# EAGLE design lightctrl (EAGLE 7.7.0)
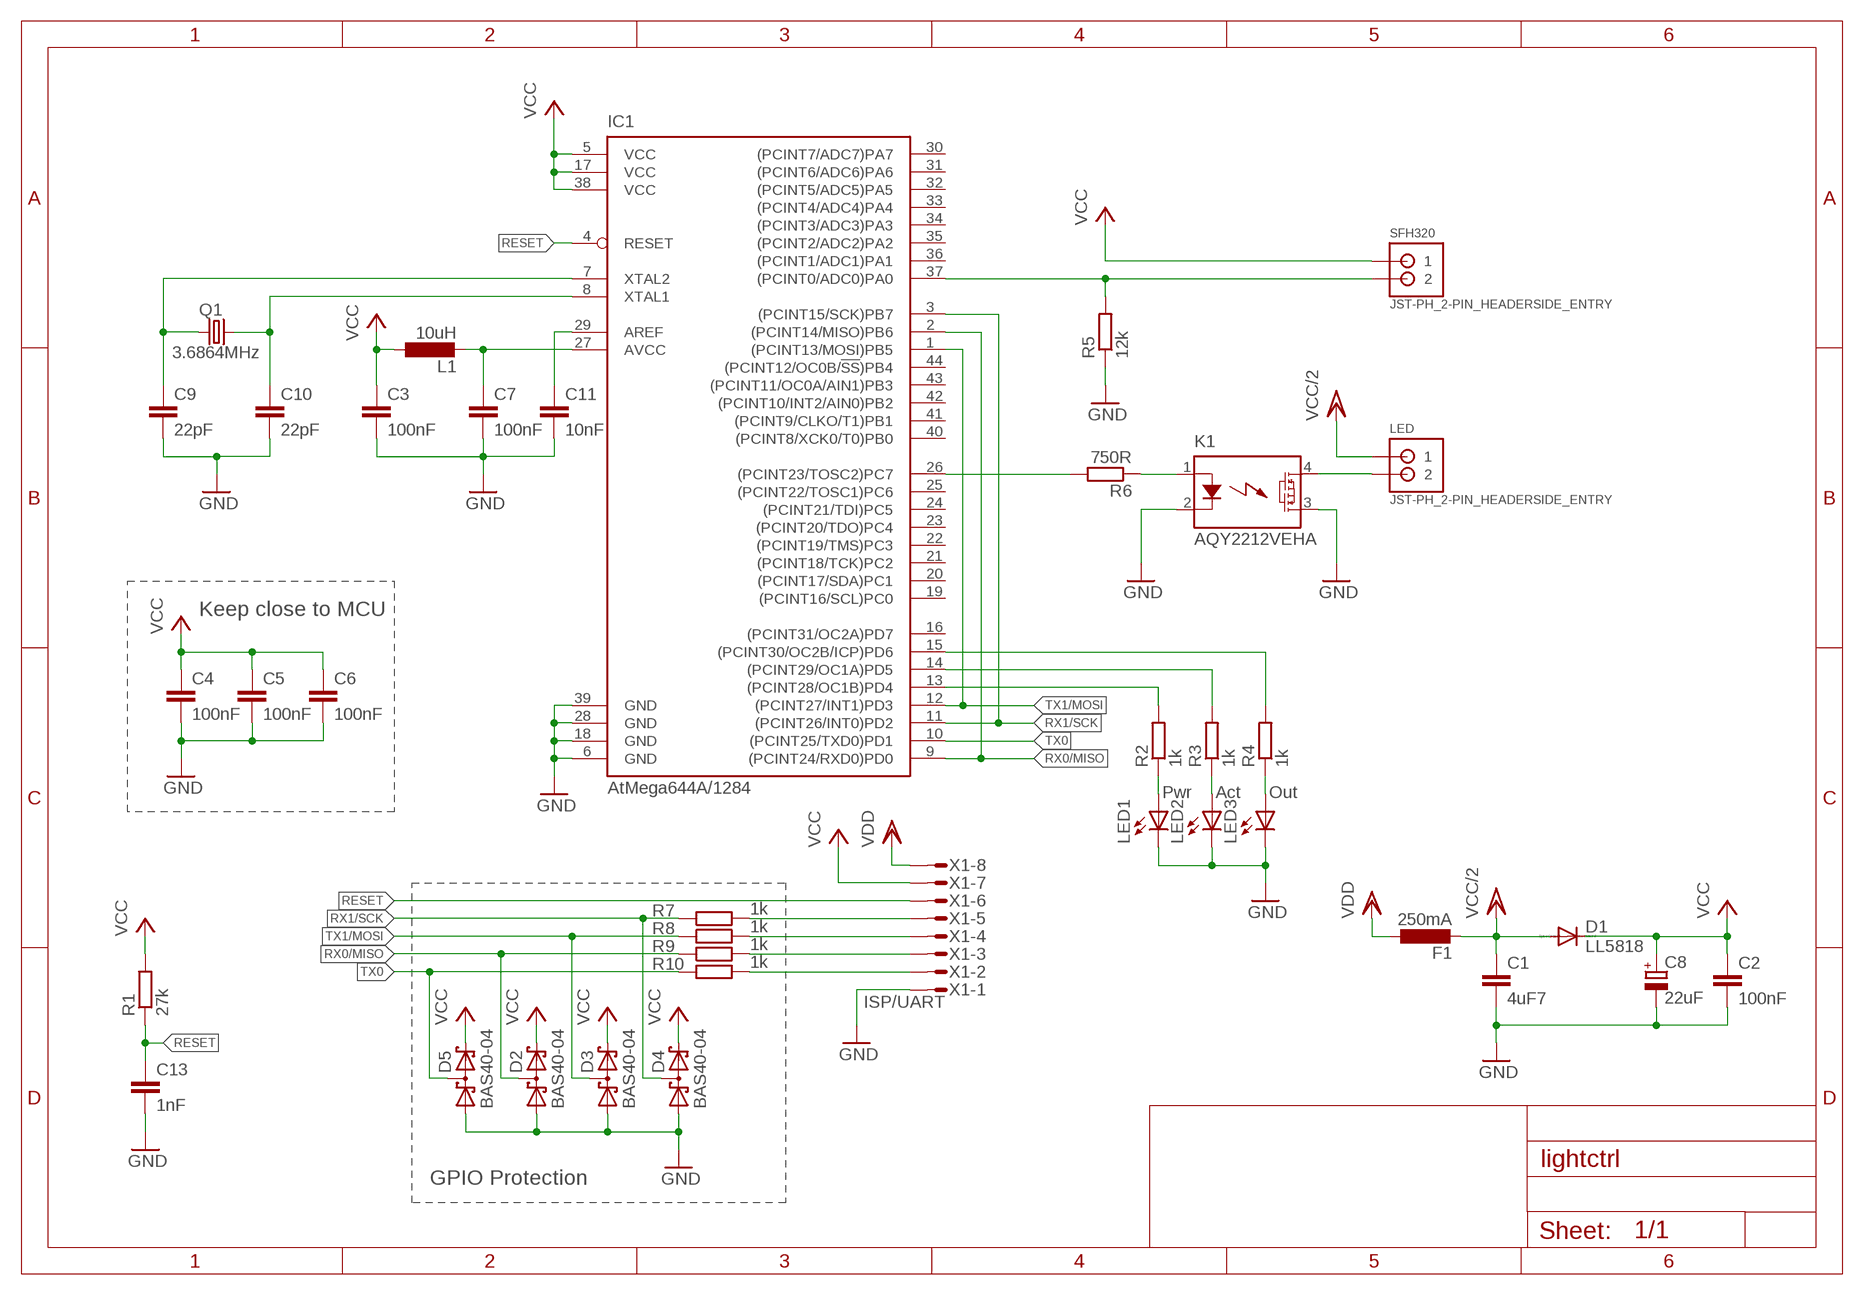
[diagram p0: schematic, sheet 1]

## Parts
C1  4uF7  C-EUC1206  [C1206]
C2  100nF  C-EUC1206  [C1206]
C3  100nF  C-EUC1206  [C1206]
C4  100nF  C-EUC1206  [C1206]
C5  100nF  C-EUC1206  [C1206]
C6  100nF  C-EUC1206  [C1206]
C7  100nF  C-EUC1206  [C1206]
C8  22uF  CPOL-EUSMCD  [SMC_D]
C9  22pF  C-EUC1206  [C1206]
C10  22pF  C-EUC1206  [C1206]
C11  10nF  C-EUC1206  [C1206]
C13  1nF  C-EUC1206  [C1206]
D1  LL5818  DIODE-MELF-MLL41  [MELF-MLL41]
D2  BAS40-04  [SOT23]
D3  BAS40-04  [SOT23]
D4  BAS40-04  [SOT23]
D5  BAS40-04  [SOT23]
F1  250mA  L-EUL1812  [L1812]
IC1  AtMega644A/1284  ATMEGA644A  [TQFP44]
K1  AQY2212VEHA  [SMD-DIP04]
L1  10uH  L-EUL3230M  [L3230M]
LED  JST-PH_2-PIN_HEADERSIDE_ENTRY  [S2B-PH_HEADER]
LED1  Pwr  LEDCHIPLED_1206  [CHIPLED_1206]
LED2  Act  LEDCHIPLED_1206  [CHIPLED_1206]
LED3  Out  LEDCHIPLED_1206  [CHIPLED_1206]
Q1  3.6864MHz  CRYSTALHC49UP  [HC49UP]
R1  27k  R-EU_R1206  [R1206]
R2  1k  R-EU_R1206  [R1206]
R3  1k  R-EU_R1206  [R1206]
R4  1k  R-EU_R1206  [R1206]
R5  12k  R-EU_R1206  [R1206]
R6  750R  R-EU_R1206  [R1206]
R7  1k  R-EU_R1206  [R1206]
R8  1k  R-EU_R1206  [R1206]
R9  1k  R-EU_R1206  [R1206]
R10  1k  R-EU_R1206  [R1206]
SFH320  JST-PH_2-PIN_HEADERSIDE_ENTRY  [S2B-PH_HEADER]
X1  ISP/UART  MICROMATCH-8  [MICROMATCH-8]

## Nets
GND: C1.2 C2.2 C3.2 C4.2 C5.2 C6.2 C7.2 C8.- C9.2 C10.2 C11.2 C13.2 D2.1(A1) D3.1(A1) D4.1(A1) D5.1(A1) IC1.6(GND) IC1.18(GND) IC1.28(GND) IC1.39(GND) K1.2(K) K1.3(DS2) LED1.C LED2.C LED3.C R5.1 X1.1
N$1: C7.1 IC1.27(AVCC) L1.2
N$2: IC1.37((PCINT0/ADC0)PA0) R5.2 SFH320.P2
N$3: C11.1 IC1.29(AREF)
N$4: C10.1 IC1.8(XTAL1) Q1.2
N$5: C9.1 IC1.7(XTAL2) Q1.1
N$6: K1.4(DS1) LED.P2
N$7: LED1.A R2.1
N$8: LED2.A R3.1
N$9: LED3.A R4.1
N$10: IC1.13((PCINT28/OC1B)PD4) R2.2
N$11: IC1.14((PCINT29/OC1A)PD5) R3.2
N$12: IC1.15((PCINT30/OC2B/ICP)PD6) R4.2
N$13: R7.2 X1.5
N$14: K1.1(A) R6.1
N$15: R8.2 X1.4
N$16: R9.2 X1.3
N$17: IC1.26((PCINT23/TOSC2)PC7) R6.2
N$18: R10.2 X1.2
RESET: C13.1 IC1.4(RESET) R1.1 X1.6
RX0/MISO: D2.3(C1A2) IC1.2((PCINT14/MISO)PB6) IC1.9((PCINT24/RXD0)PD0) R9.1
RX1/SCK: D4.3(C1A2) IC1.3((PCINT15/SCK)PB7) IC1.11((PCINT26/INT0)PD2) R7.1
TX0: D5.3(C1A2) IC1.10((PCINT25/TXD0)PD1) R10.1
TX1/MOSI: D3.3(C1A2) IC1.1((PCINT13/MOSI)PB5) IC1.12((PCINT27/INT1)PD3) R8.1
VCC: C2.1 C3.1 C4.1 C5.1 C6.1 C8.+ D1.C D2.2(C2) D3.2(C2) D4.2(C2) D5.2(C2) IC1.5(VCC) IC1.17(VCC) IC1.38(VCC) L1.1 R1.2 SFH320.P1 X1.7
VCC/2: C1.1 D1.A F1.2 LED.P1
VDD: F1.1 X1.8
Unconnected: IC1.16((PCINT31/OC2A)PD7) IC1.19((PCINT16/SCL)PC0) IC1.20((PCINT17/SDA)PC1) IC1.21((PCINT18/TCK)PC2) IC1.22((PCINT19/TMS)PC3) IC1.23((PCINT20/TDO)PC4) IC1.24((PCINT21/TDI)PC5) IC1.25((PCINT22/TOSC1)PC6) IC1.30((PCINT7/ADC7)PA7) IC1.31((PCINT6/ADC6)PA6) IC1.32((PCINT5/ADC5)PA5) IC1.33((PCINT4/ADC4)PA4) IC1.34((PCINT3/ADC3)PA3) IC1.35((PCINT2/ADC2)PA2) IC1.36((PCINT1/ADC1)PA1) IC1.40((PCINT8/XCK0/T0)PB0) IC1.41((PCINT9/CLKO/T1)PB1) IC1.42((PCINT10/INT2/AIN0)PB2) IC1.43((PCINT11/OC0A/AIN1)PB3) IC1.44((PCINT12/OC0B/!SS!)PB4)

## Notes on the sheet
- Keep close to MCU
- GPIO Protection

## Library data of the parts
C1-C7 C9-C11 C13 = rcl:C-EU: CAPACITOR, European symbol
C8 = rcl:CPOL-EU: POLARIZED CAPACITOR, European symbol
D1 = diode:DIODE-: DIODE
D2-D5 = diode:BAS40-04: Silicon Schottky Diodes General-purpose diode for high-speed switching
F1 L1 = rcl:L-EU: INDUCTOR, European symbol
IC1 = atmel:ATMEGA644: 8-bit Microcontroller with 64K Bytes In-System Programmable Flash Source: http://www.atmel.com/dyn/resources/prod_documents/doc2593.pdf; MPN: ATMEGA644PV-10AU; OC_FARNELL: 1455123; OC_NEWARK: 58M3748
K1 = tpv:AQY221*2V: PHOTOMOS Relay RF (Radio Frequency) NAiS C . R 10 SSOP Type; Source: http://www.mew-europe.com/.. aqy221_2v.pdf
LED SFH320 = con-jst-ph:JST-PH_2-PIN_HEADER: 2-pin JST PH Shrouded Header P/N B2B-PH-K-S Mating connector PHR-2 Mating cable assembly: Sparkfun PRT-09914 <http://www.sparkfun.com/products/9914>
LED1-LED3 = led:LED: LED OSRAM: - CHIPLED LG R971, LG N971, LY N971, LG Q971, LY Q971, LO R971, LY R971 LH N974, LH R974 LS Q976, LO Q976, LY Q976 LO Q996 - Hyper CHIPLED LW Q18S LB Q993, LB Q99A, LB R99A - SideLED LS A670, LO A670, LY A670, LG A670, LP A670 LB A673, LV A673, LT A673, LW A673 LH A674 LY A675 LS A676, LA A676, LO A676, LY A676, LW A676 LS A679, LY A679, LG A679 - Hyper Micro SIDELED® LS Y876, LA Y876, LO Y876, LY Y876 LT Y87S - SmartLED LW L88C, LW L88S LB L89C, LB L89S, LG L890 LS L89K, LO L89K, LY L89K LS L896, LA L896, LO L896, LY L896 - TOPLED LS T670, LO T670, LY T670, LG T670, LP T670 LSG T670, LSP T670, LSY T670, LOP T670, LYG T670 LG T671, LOG T671, LSG T671 LB T673, LV T673, LT T673, LW T673 LH T674 LS T676, LA T676, LO T676, LY T676, LB T676, LH T676, LSB T676, LW T676 LB T67C, LV T67C, LT T67C, LS T67K, LO T67K, LY T67K, LW E67C LS E67B, LA E67B, LO E67B, LY E67B, LB E67C, LV E67C, LT E67C LW T67C LS T679, LY T679, LG T679 LS T770, LO T770, LY T770, LG T770, LP T770 LB T773, LV T773, LT T773, LW T773 LH T774 LS E675, LA E675, LY E675, LS T675 LS T776, LA T776, LO T776, LY T776, LB T776 LHGB T686 LT T68C, LB T68C - Hyper Mini TOPLED® LB M676 - Mini TOPLED Santana® LG M470 LS M47K, LO M47K, LY M47K Source: http://www.osram.convergy.de LUXEON: - LUMILED® LXK2-PW12-R00, LXK2-PW12-S00, LXK2-PW14-U00, LXK2-PW14-V00 LXK2-PM12-R00, LXK2-PM12-S00, LXK2-PM14-U00 LXK2-PE12-Q00, LXK2-PE12-R00, LXK2-PE12-S00, LXK2-PE14-T00, LXK2-PE14-U00 LXK2-PB12-K00, LXK2-PB12-L00, LXK2-PB12-M00, LXK2-PB14-N00, LXK2-PB14-P00, LXK2-PB14-Q00 LXK2-PR12-L00, LXK2-PR12-M00, LXK2-PR14-Q00, LXK2-PR14-R00 LXK2-PD12-Q00, LXK2-PD12-R00, LXK2-PD12-S00 LXK2-PH12-R00, LXK2-PH12-S00 LXK2-PL12-P00, LXK2-PL12-Q00, LXK2-PL12-R00 Source: www.luxeon.com KINGBRIGHT: KA-3528ASYC Source: www.kingbright.com
Q1 = crystal:CRYSTAL: CRYSTAL; OC_FARNELL: unknown; OC_NEWARK: unknown
R1-R10 = rcl:R-EU_: RESISTOR, European symbol
X1 = con-amp-micromatch:MICROMATCH-8: MicroMaTch 8 7-215464-8 / 0-215464-8 Drawing Number C-215464 DDEController.pdf; MF: FARNELL; MPN: 7-215464-8; OC_FARNELL: 3784642; OC_NEWARK: 26H0301

## Board
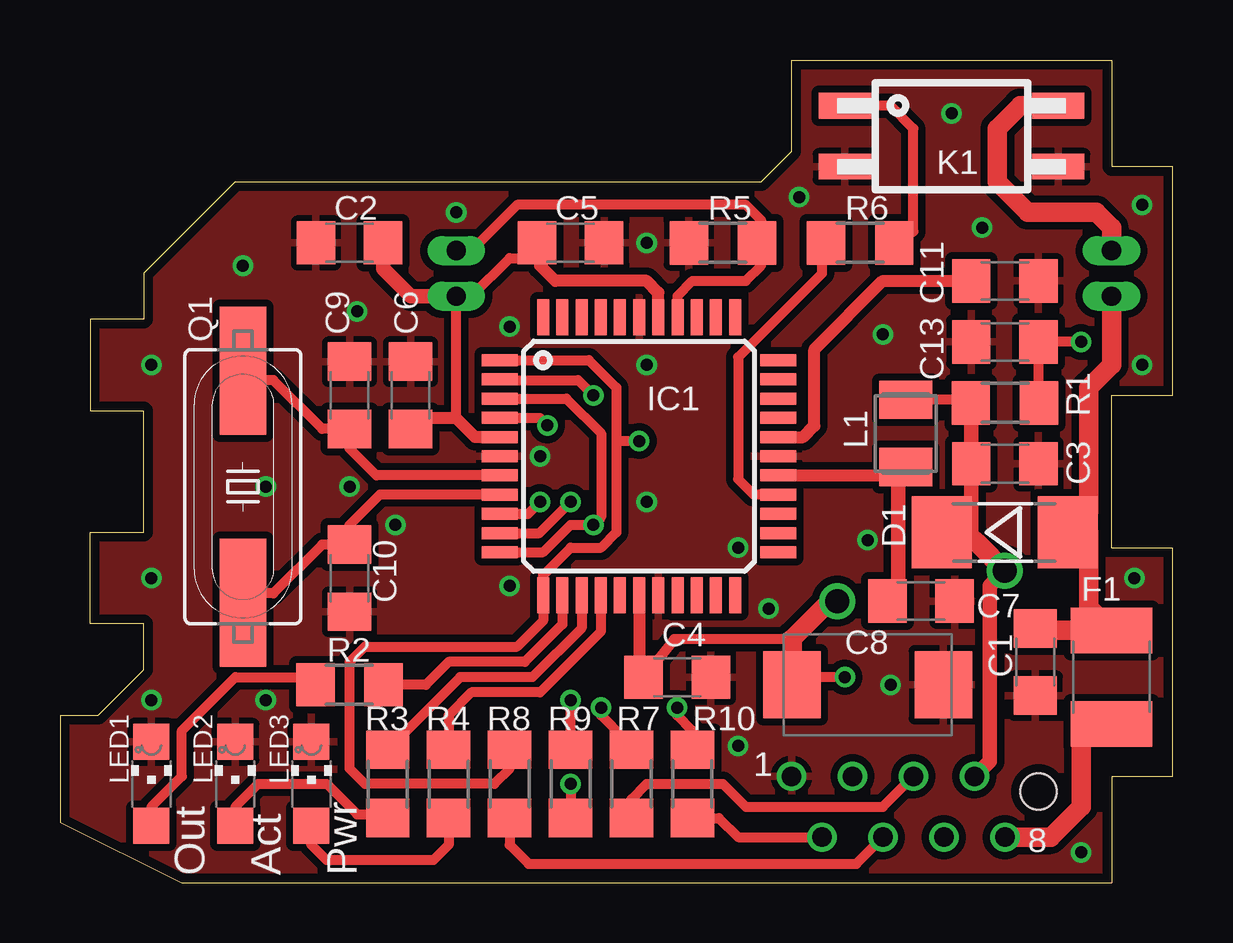
[diagram p1: board, top side]
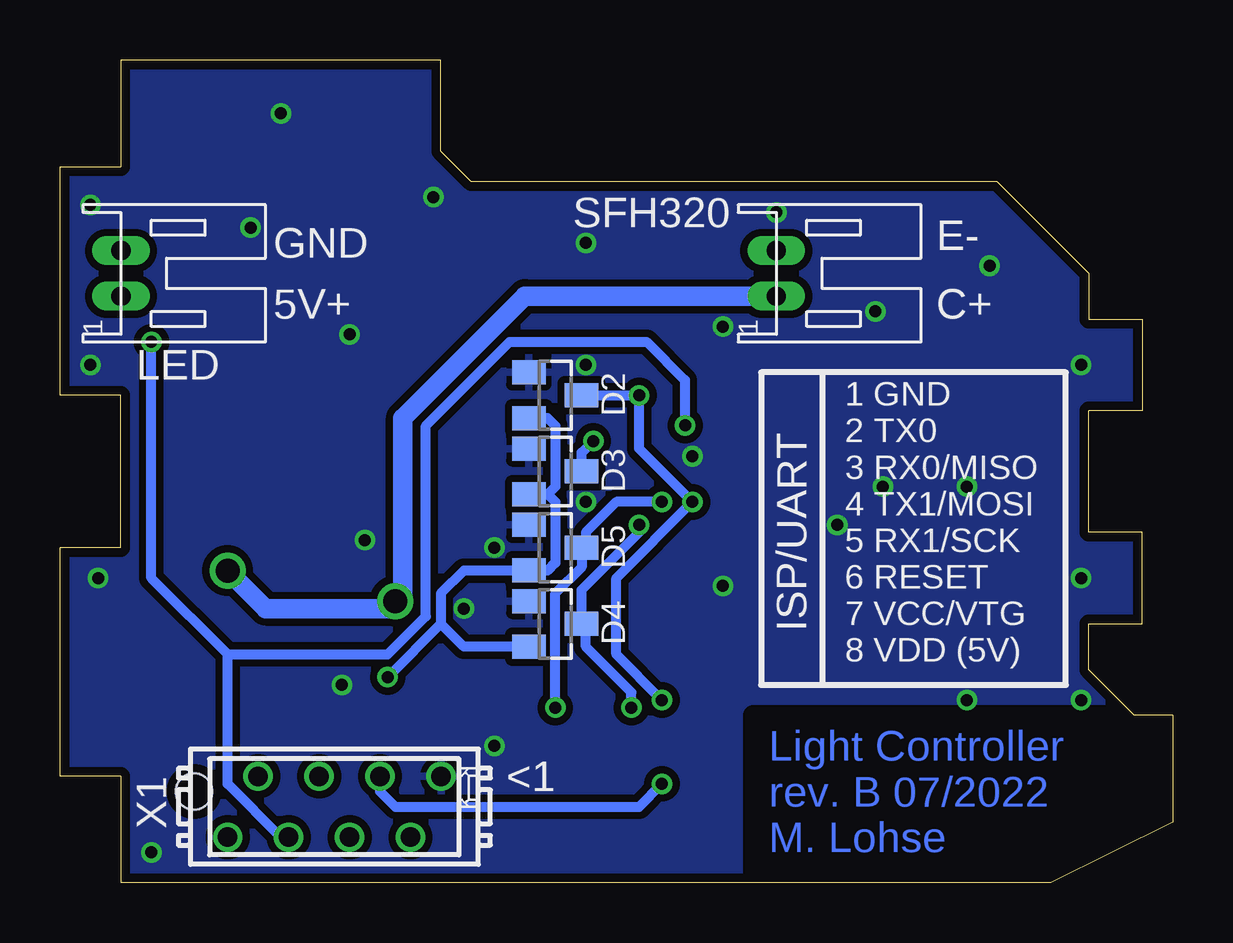
[diagram p2: board, bottom side, seen from below]

Size 46.35 x 34.29 mm. Coordinates in mm from the lower left corner, seen from the top.
Outline: 5.08,0 43.81,0 43.81,4.45 46.35,4.45 46.35,13.97 43.81,13.97 43.81,20.32 46.35,20.32 46.35,29.84 43.81,29.84 43.81,34.29 30.48,34.29 30.48,30.48 29.21,29.21 7.3,29.21 3.49,25.4 3.49,23.5 1.27,23.5 1.27,19.68 3.49,19.68 3.49,14.61 1.27,14.61 1.27,10.79 3.49,10.79 3.49,8.89 1.59,6.99 0,6.99 0,2.54 5.08,0
Copper layers (1*16): Top 0.0356mm / dielectric 1.5011mm / Bottom 0.0356mm
Design rules "LaenPCBOrder": minimum track width 6mil, minimum drill 13mil, track to track 6mil, track to pad 6mil, pad to pad 6mil, via to via 6mil, smd to smd 6mil, copper to edge 15mil, drill to drill 6mil, minimum pad ring 7mil, minimum via ring 7mil, stop-mask expansion 3mil, vias tented up to drill 0mil, thermal gap 10mil
bRestrict: 5 lines

### Footprints (pad centres in the part's own frame; a part is rotated, then mirrored left to right if it is on the bottom)
C1206 = smd 1.6 x 1.8: 1 -1.4,0; 2 1.4,0
SMC_D = smd 2.4 x 2.8: + -3.15,0; - 3.15,0
MELF-MLL41 = smd 2.5 x 3: A 2.625,0; C -2.625,0
SOT23 = smd 1 x 1.4: 1 -0.95,-1.1; 2 0.95,-1.1; 3 0,1.1
L1812 = smd 1.9 x 3.4: 1 -1.95,0; 2 1.95,0
TQFP44 = smd 1.5 x 0.5: 1 -5.8,4; 2 -5.8,3.2; 3 -5.8,2.4; 4 -5.8,1.6; 5 -5.8,0.8; 6 -5.8,0; 7 -5.8,-0.8; 8 -5.8,-1.6; 9 -5.8,-2.4; 10 -5.8,-3.2; 11 -5.8,-4; 23 5.8,-4; 24 5.8,-3.2; 25 5.8,-2.4; 26 5.8,-1.6; 27 5.8,-0.8; 28 5.8,0; 29 5.8,0.8; 30 5.8,1.6; 31 5.8,2.4; 32 5.8,3.2; 33 5.8,4 | smd 0.5 x 1.5: 12 -4,-5.8; 13 -3.2,-5.8; 14 -2.4,-5.8; 15 -1.6,-5.8; 16 -0.8,-5.8; 17 0,-5.8; 18 0.8,-5.8; 19 1.6,-5.8; 20 2.4,-5.8; 21 3.2,-5.8; 22 4,-5.8; 34 4,5.8; 35 3.2,5.8; 36 2.4,5.8; 37 1.6,5.8; 38 0.8,5.8; 39 0,5.8; 40 -0.8,5.8; 41 -1.6,5.8; 42 -2.4,5.8; 43 -3.2,5.8; 44 -4,5.8
SMD-DIP04 = smd 2.184 x 1.067: 1 -4.445,1.27; 2 -4.445,-1.27; 3 4.445,-1.27; 4 4.445,1.27
L3230M = smd 1.6 x 2.2: 1 -1.4,0; 2 1.4,0
S2B-PH_HEADER = drill 0.8 long: P1 0.953,-1.905; P2 -0.953,-1.905
CHIPLED_1206 = smd 1.5 x 1.5: A 0,-1.75; C 0,1.75
HC49UP = smd 5.334 x 1.93: 1 -4.826,0; 2 4.826,0
R1206 = smd 1.6 x 1.803: 1 -1.422,0; 2 1.422,0
MICROMATCH-8 = drill 0.813: 1 4.445,1.27; 2 3.175,-1.27; 3 1.905,1.27; 4 0.635,-1.27; 5 -0.635,1.27; 6 -1.905,-1.27; 7 -3.175,1.27; 8 -4.445,-1.27 | hole 1.5: -5.85,0.635

### Placement (x,y rotation side)
C1  40.64,9.21 270 top
C2  12.06,26.67 180 top
C3  39.37,17.46 0 top
C4  25.72,8.57 0 top
C5  21.27,26.67 0 top
C6  14.61,20.32 90 top
C7  35.88,11.75 0 top
C8  33.66,8.26 0 top
C9  12.06,20.32 90 top
C10  12.06,12.7 270 top
C11  39.37,25.08 0 top
C13  39.37,22.54 180 top
D1  39.37,14.61 0 top
D2  25.72,20.32 270 bottom
D3  25.72,17.14 270 bottom
D4  25.72,10.79 270 bottom
D5  25.72,13.97 270 bottom
F1  43.81,8.57 90 top
IC1  24.13,17.78 0 top
K1  37.15,31.11 0 top
L1  35.24,18.73 270 top
LED  41.91,25.4 270 bottom
LED1  3.81,4.13 0 top
LED2  7.3,4.13 0 top
LED3  10.48,4.13 0 top
Q1  7.62,16.51 270 top
R1  39.37,20 180 top
R2  12.06,8.26 0 top
R3  13.65,4.13 90 top
R4  16.19,4.13 90 top
R5  27.62,26.67 0 top
R6  33.34,26.67 180 top
R7  23.81,4.13 270 top
R8  18.73,4.13 270 top
R9  21.27,4.13 270 top
R10  26.35,4.13 270 top
SFH320  14.61,25.4 270 bottom
X1  34.92,3.17 0 bottom

### Tracks (layer width: path | path; a pad name or v marks a point on that pad's centre or on a via)
GND  (via drill 0.5)
  other vias: 44.77,12.7 24.45,21.59 29.53,11.43 3.81,7.62 7.62,25.72 30.8,28.57 24.45,15.88 8.57,16.51 34.61,8.26 38.42,27.3 37.15,32.07 12.38,23.81 20,17.78 12.06,16.51 42.55,1.27 34.29,22.86 45.09,28.26 8.57,7.62 13.97,14.92 28.26,13.97 33.66,14.29 24.45,26.67 18.73,12.38 45.09,21.59 18.73,23.18 16.51,27.94 3.81,21.59 3.81,12.7 28.26,5.71
  pour Bottom (isolate 0.305): 0,0 46.04,0 46.35,34.29 0,34.29
  pour Top (isolate 0.305): 0,0 46.04,0 46.35,34.29 0,34.29
N$1
  Top 0.305: 34.89,16.98 L1.2
  Top 0.5: IC1.27 34.89,16.98
  Top 0.61: L1.2 34.92,17.02 34.92,12.38 34.48,11.94 C7.1
N$2
  Top 0.406: IC1.37 25.73,24.46 26.35,25.08 28.57,25.08 29.21,25.72 29.21,26.5 R5.2 29.21,26.84 29.21,27.62 28.57,28.26 19.05,28.26 17.14,26.35 SFH320.P2
N$3
  Top 0.5: IC1.29 30.96,18.58 31.43,19.05 31.43,22.23 34.29,25.08 C11.1
N$4
  Top 0.406: Q1.2 8,12.06 8.89,12.06 10.93,14.1 C10.1 12.06,14.92 13.34,16.19 18.32,16.19 IC1.8
N$5
  Top 0.406: Q1.1 8,20.95 8.89,20.95 10.93,18.92 C9.1 12.06,18.1 13.18,16.98 IC1.7
N$6
  Top 0.813: K1.4 40.01,32.38 39.05,31.43 39.05,29.21 40.32,27.94 43.18,27.94 43.81,27.3 LED.P2
N$7
  Top 0.406: LED1.A 3.81,3.17 5.08,4.45 5.08,6.35 7.3,8.57 10.32,8.57 R2.1
N$8
  Top 0.406: LED2.A 7.3,3.17 8.26,4.13 11.11,4.13 12.38,2.86 13.5,2.86 R3.1
N$9
  Top 0.406: R4.1 16.19,1.59 15.56,0.95 11.11,0.95 10.48,1.59 LED3.A
N$10
  Top 0.406: IC1.13 20.93,10.77 19.37,9.21 16.19,9.21 15.24,8.26 R2.2
N$11
  Top 0.406: IC1.14 21.73,10.62 19.68,8.57 16.68,8.57 R3.2
N$12
  Top 0.406: IC1.15 22.53,10.46 20,7.94 17.14,7.94 16.19,6.99 R4.2
N$13
  Top 0.406: R7.2 23.81,3.49 24.45,4.13 27.62,4.13 28.57,3.17 34.29,3.17 X1.5
N$14
  Top 0.406: K1.1 34.61,32.38 35.56,31.43 35.56,27.14 R6.1
N$15
  Top 0.406: R8.2 18.73,1.59 19.53,0.79 33.18,0.79 X1.4
N$16  (via drill 0.5)
  Top 0.406: v21.27,4.13 R9.2
  Bottom 0.406: X1.3 33.02,3.81 32.38,3.17 22.23,3.17 v21.27,4.13
N$17
  Top 0.406: IC1.26 29.92,16.19 28.89,16.19 28.26,16.83 28.26,21.91 31.75,25.4 31.75,26.5 R6.2
N$18
  Top 0.406: R10.2 27.46,2.71 28.26,1.91 X1.2
RESET  (via drill 0.5)
  Top 0.406: v42.55,22.54 C13.1 40.77,20.02 R1.1 | IC1.4 19.99,19.38 v20.31,19.06
  Bottom 0.406: 39.37,9.53 39.37,4.13 37.15,1.91 X1.6 | v42.55,22.54 42.55,12.7 39.37,9.53 | 39.37,9.53 32.7,9.53 31.11,11.11 31.11,19.05 27.62,22.54 21.91,22.54 20.32,20.95 20.32,19.39 v20.31,19.06
RX0/MISO  (via drill 0.5)
  Top 0.406: IC1.9 19.51,15.38 v20,15.88 | IC1.2 18.36,20.95 21.59,20.95 v22.23,20.32 | R9.1 21.12,5.55 20.64,6.03 20.95,6.03 21.27,5.71 v21.27,7.62
  Bottom 0.406: D2.3 v22.23,20.32 22.23,18.1 v20,15.88 23.18,12.7 23.18,9.53 v21.27,7.62
RX1/SCK  (via drill 0.5)
  Top 0.406: IC1.3 21.09,20.18 22.54,18.73 22.54,15.24 v22.23,14.92 21.27,14.92 20.13,13.78 IC1.11 | v22.54,7.3 22.54,6.99 23.5,6.03 23.5,5.87 R7.1
  Bottom 0.406: v22.54,7.3 22.54,7.94 24.45,9.84 24.45,10.62 D4.3 24.62,12.21 22.23,14.61 v22.23,14.92
TX0  (via drill 0.5)
  Top 0.406: IC1.10 19.98,14.58 v21.27,15.88 | R10.1 26.35,6.35 25.72,6.99 v25.72,7.3
  Bottom 0.406: v21.27,15.88 23.18,15.88 24.45,14.61 24.45,14.14 D5.3 24.62,13.16 25.72,12.06 v25.72,7.3
TX1/MOSI  (via drill 0.5)
  Top 0.406: IC1.1 22.04,21.78 23.18,20.64 23.18,18.41 | 23.18,18.41 23.18,14.61 22.54,13.97 21.27,13.97 20.13,12.83 IC1.12 20.13,10.92 19.05,9.84 12.7,9.84 12.06,9.21 12.06,4.76 12.7,4.13 18.1,4.13 18.73,4.76 R8.1 | v24.13,18.41 23.18,18.41
  Bottom 0.406: D3.3 24.62,17.93 v24.13,18.41
VCC  (via drill 0.5, 1)
  Top 0.406: 37.97,19.98 R1.2 37.82,20.13 L1.1 | 39.05,12.7 v39.37,13.02 | 16.51,19.37 SFH320.P1 17.14,24.45 18.73,26.04 20,26.04 | C8.+ 30.48,8.28 30.48,10.16 25.59,10.16 C4.1 24.13,8.76 | 30.16,7.62 30.16,7.91 C8.+ | v32.7,8.57 30.82,8.57 C8.+ | 15.05,19.37 C6.1
  Top 0.5: IC1.5 17.3,18.58 16.51,19.37 15.05,19.37 | IC1.38 24.93,24.6 24.45,25.08 20.64,25.08 20,25.72 20,26.04 | IC1.17 24.13,8.76
  Top 0.61: X1.7 38.73,5.08 38.73,12.38 v39.37,13.02 | 37.06,14.29 D1.C | 37.97,19.98 C3.1 37.97,14.42 38.26,14.13 | C2.1 13.46,25.59 14.61,24.45 SFH320.P1 | 20,26.04 20,26.54 C5.1
  Top 0.813: v39.37,13.02 38.26,14.13 38.1,14.29 37.06,14.29 | v32.38,11.75 32.07,11.75 30.5,10.19 C8.+
  Bottom 0.406: D2.2 26.04,19.37 25.72,19.05 25.72,16.51 26.04,16.19 | D3.2 26.04,16.19 | 26.04,16.19 25.72,15.88 25.72,13.34 26.04,13.02 D5.2 | D5.2 26.04,13.02 | D4.2 29.53,9.85 30.48,10.79 | D5.2 29.53,13.02 30.48,12.06 30.48,10.79 | 30.48,10.79 v32.7,8.57
  Bottom 0.813: SFH320.P1 26.99,24.45 32.07,19.37 32.07,12.06 v32.38,11.75 32.7,11.43 37.78,11.43 v39.37,13.02
VCC/2
  Top 0.813: C1.1 40.73,10.52 F1.2 42.86,11.47 42.86,14.61 42.43,15.04 | LED.P1 43.81,21.59 42.86,20.64 42.86,15.47 42.43,15.04 | 42.43,15.04 D1.A
VDD
  Top 0.813: X1.8 41.27,1.91 42.55,3.17 42.55,6.35 43.54,6.35 F1.1

### Text on the board
Bottom: Light Controller / rev. B 07/2022 / M. Lohse
tNames: 1 | 8 | Out | Act | Pwr
bNames: E- | GND | C+ | 5V+ | ISP/UART | 1 GND / 2 TX0 / 3 RX0/MISO / 4 TX1/MOSI / 5 RX1/SCK / 6 RESET / 7 VCC/VTG / 8 VDD (5V) | <1
bStop: Light Controller / rev. B 07/2022 / M. Lohse